# Altium schematic sheet TSAL.SchDoc: QUTMS - HVBoard - TSAL
size A4; DocumentNumber: 3; SheetNumber: 3; SheetTotal: 5
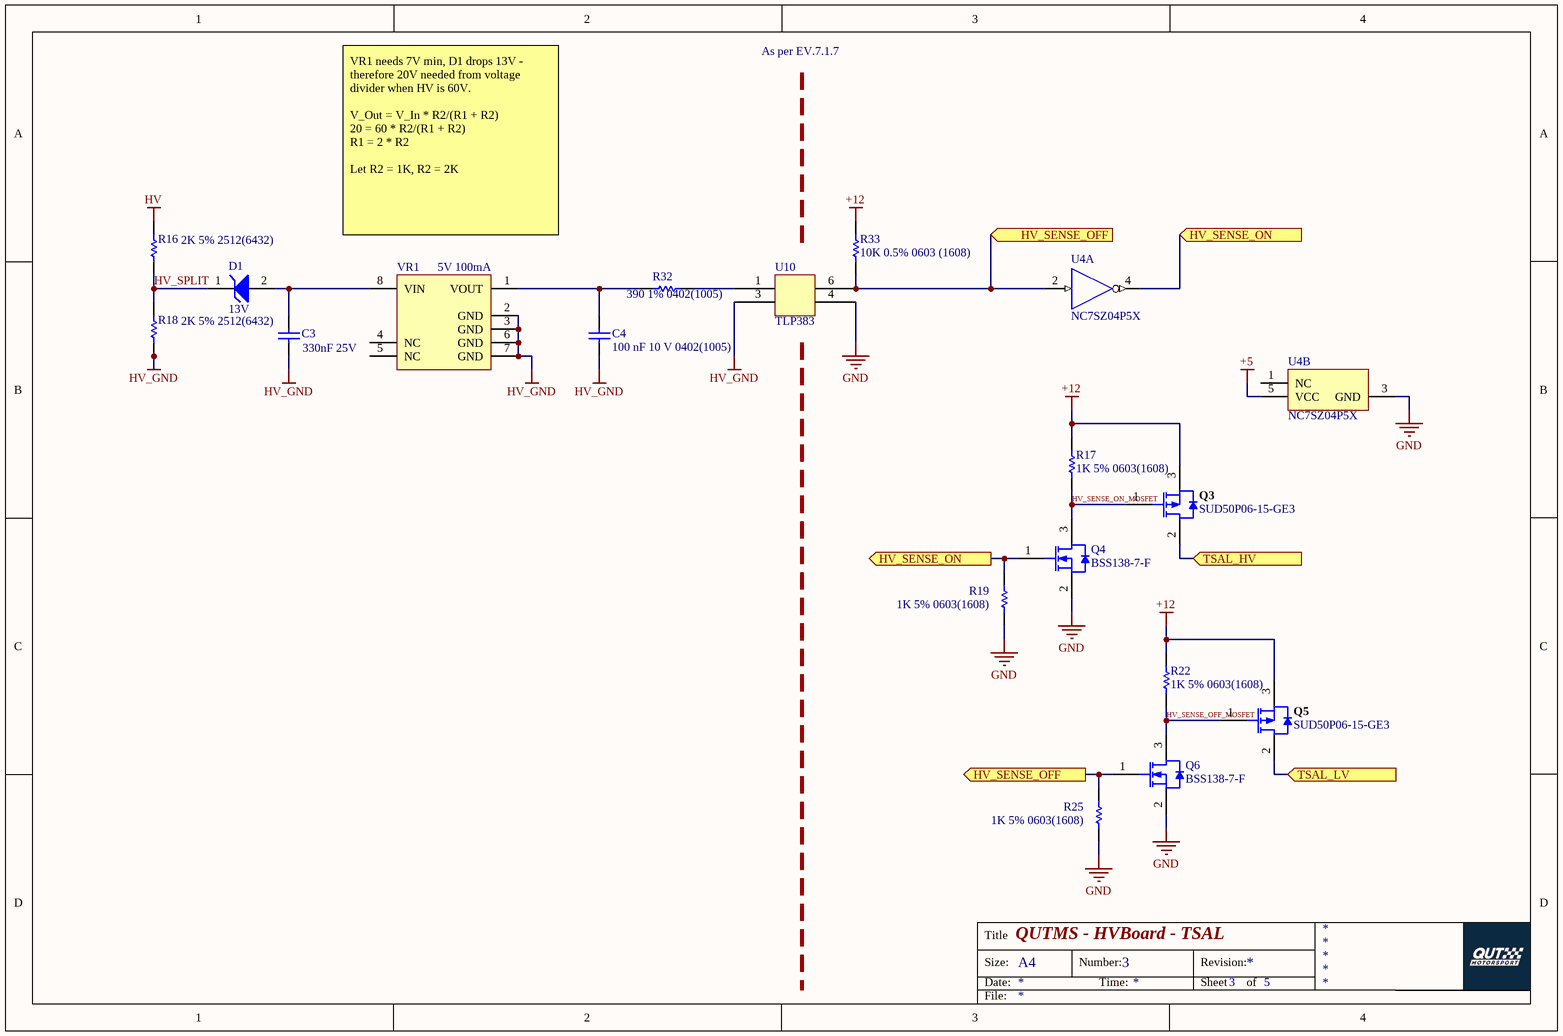
[diagram p0: TSAL.SchDoc]

## Parts
C3  330nF 25V  [CAPC0603(1608)100_M]
C4  100 nF 10 V 0402(1005)  [CAPC1005X60X30ML05T10]
D1  13V  [ONSC-SOD-323-2-477-02_V]
Q3  SUD50P06-15-GE3  [VSIL-TO-252AA-3_V]
Q4  BSS138-7-F  [DIOD-SOT23-3_V]
Q5  SUD50P06-15-GE3  [VSIL-TO-252AA-3_V]
Q6  BSS138-7-F  [DIOD-SOT23-3_V]
R16  2K 5% 2512(6432)  [RESC2512(6432)_L]
R17  1K 5% 0603(1608)  [RESC0603(1608)_L]
R18  2K 5% 2512(6432)  [RESC2512(6432)_L]
R19  1K 5% 0603(1608)  [RESC0603(1608)_L]
R22  1K 5% 0603(1608)  [RESC0603(1608)_L]
R25  1K 5% 0603(1608)  [RESC0603(1608)_L]
R32  390 1% 0402(1005)  [RESC1609X50X30NL10T20]
R33  10K 0.5% 0603 (1608)  [RESC1608X50X30LL20T20]
U4  NC7SZ04P5X  [FAIR-SC70-5_V]  (parts A,B of 2)
U10  TLP383  [TLP383]
VR1  5V 100mA  [SO8_N]

## Ports
HV_SENSE_OFF (in), HV_SENSE_OFF (out), HV_SENSE_ON (in), HV_SENSE_ON (out), TSAL_HV (in), TSAL_LV (in)

## Nets
+5: U4.5(VCC)
+12: Q3.3(S) Q5.3(S) R17.2 R22.2 R33.2
GND: Q4.2(S) Q6.2(S) R19.1 R25.1 U4.3(GND) U10.4
HV: R16.2
HV_GND: C3.1 C4.1 R18.1 U10.3 VR1.2(GND) VR1.3(GND) VR1.6(GND) VR1.7(GND)
HV_SENSE_OFF: Q6.1(G) R25.2 R33.1 U4.2(A) U10.6 ; port HV_SENSE_OFF
HV_SENSE_OFF_MOSFET: Q5.1(G) Q6.3(D) R22.1
HV_SENSE_ON: Q4.1(G) R19.2 U4.4(Y) ; port HV_SENSE_ON
HV_SENSE_ON_MOSFET: Q3.1(G) Q4.3(D) R17.1
HV_SPLIT: D1.1(K) R16.1 R18.2
TSAL_HV: Q3.2(D) ; port TSAL_HV
TSAL_LV: Q5.2(D) ; port TSAL_LV
NetC3_2: C3.2 D1.2(A) VR1.8(VIN)
NetC4_2: C4.2 R32.1 VR1.1(VOUT)
NetR32_2: R32.2 U10.1

Not connected (* = marked no-connect by the designer): U4 1(NC); VR1 4(NC) 5(NC)

## Notes on the sheet
- As per EV.7.1.7
- VR1 needs 7V min, D1 drops 13V - therefore 20V needed from voltage divider when HV is 60V.
  V_Out = V_In * R2/(R1 + R2)
  20 = 60 * R2/(R1 + R2)
  R1 = 2 * R2
  Let R2 = 1K, R2 = 2K
- Title
- Size:
- Date:
- A4
- Number:
- Time:
- Revision:
- Sheet
- of
- File:

## Library data of the parts
C3 = CMP-1035-02675-1: CAP 330nF 25V ±20% 0603 (1608 Metric) Thickness 1mm SMD; Case-EIA: 0603; Case-Metric: 1608; Tolerance: Â±20%; Max Thickness: 1 mm; Technology: SMT; Rated Voltage: 25 V; Value: 330nF
C4 = CMP-2008-02063-1: Part Number: C0402C104K8PAC7867; Manufacturer: Kemet
D1 = CMP-1060-00637-1: Zener Voltage Regulator, 300 mW, Tight Tolerance Portfolio, 2-Pin SOD-323, Pb-Free, Tape and Reel; PartNumber: MM3Z13VT1G; Manufacturer: On Semiconductor; P Max (W): 0.3; VZ Typ (V): 13.25; ComponentLink2URL: http://www.onsemi.cn/pub_link/Collateral/MM3Z2V4ST1-D.PDF; RoHS: Pb-Free; PackageVersion: Rev. H, 03/2007; PackageReference: SOD-323-2-477-02; DatasheetVersion: Rev. 21; ComponentLink2Description: Datasheet; Mounting Technology: Surface Mount; Packing: Tape and Reel; ComponentLink1Description: Manufacturer URL; ComponentLink1URL: http://www.onsemi.com/; ComponentLink3Description: Package Specification; PackageDescription: 2-Pin SOD, Body 1.7 x 1.25 mm; ComponentLink3URL: http://www.onsemi.com/pub_link/Collateral/477-02.PDF.1
Q3 Q5 = CMP-2000-05431-1: P-Channel (D-S) MOSFET, 30 V, -55 to 150 degC, 3-Pin TO-252, RoHS, Tape and Reel; Manufacturer: Vishay; Unit Weight: 0.050717oz; Id - Continuous Drain Current: 50A; Rise Time: 70ns; Fall Time: 175ns; Configuration: Single; Rds On - Drain-Source Resistance: 15mOhms; Transistor Type: 1P-Channel; Channel Mode: Enhancement; Number of Channels: 1Channel; Typical Turn-On Delay Time: 15ns; Brand: VishaySemiconductors; Pd - Power Dissipation: 2.5W; Vds - Drain-Source Breakdown Voltage: -60V; Vgs - Gate-Source Voltage: 20V; Mounting Style: SMD/SMT; Package / Case: TO-252AA-3; Height: 2.39mm; Datasheet Version: Rev. C, 07/2013; Factory Pack Quantity: 2000; RoHS: True; Typical Turn-Off Delay Time: 175ns; Minimum Operating Temperature: -55C; Tradename: TrenchFET; Manufacturer URL: http://www.vishay.com/; Package Description: 3-Pin Surface Mount Device, Body 6.54 x 6.095 mm, Pitch 2.28 mm; Package Reference: TO-252; Transistor Polarity: P-Channel; Technology: Si; Series: SUD; Datasheet URL: https://datasheet.ciiva.com/4444/sud50p06-244530-4444327.pdf; Width: 6.22mm; Product Category: MOSFET; Packaging: Reel; Length: 6.73mm; Package URL: http://www.vishay.com/docs/89975/v15wl45c-m3.pdf; Maximum Operating Temperature: +150C
Q4 Q6 = CMP-2000-04930-1: N-Channel Enhancement Mode Mosfet, 50 V, 0.2 A, -55 to 150 degC, 3-Pin SOT23, RoHS, Tape and Reel; Manufacturer: Diodes Inc; Brand: DiodesIncorporated; Unit Weight: 0.000282oz; Pd - Power Dissipation: 300mW; Id - Continuous Drain Current: 200mA; Rds On - Drain-Source Resistance: 3.5Ohms; Vgs - Gate-Source Voltage: 20V; Number of Channels: 1Channel; Vds - Drain-Source Breakdown Voltage: 50V; Transistor Type: 1N-Channel; Typical Turn-Off Delay Time: 20ns; Configuration: Single; Mounting Style: SMD/SMT; Height: 1mm; Package Description: 3-Pin Small Outline Transistor, Body 2.9 x 1.3 mm, Pitch 0.96 mm; Datasheet Version: Rev. 20-2, 11/2013; Minimum Operating Temperature: -55C; Package / Case: SOT-23-3; Channel Mode: Enhancement; Product: MOSFETSmallSignal; Packaging: Reel; Maximum Operating Temperature: +150C; Datasheet URL: https://datasheet.ciiva.com/8115/ds30144-8115344.pdf; Product Category: MOSFET; Width: 1.3mm; Technology: Si; Package Reference: SOT23-3; Manufacturer URL: http://www.diodes.com/; Transistor Polarity: N-Channel; Length: 2.9mm; Factory Pack Quantity: 3000; Series: BSS138; RoHS: True; Typical Turn-On Delay Time: 20ns
R16 R18 = CMP-1018-00081-1: 2K 1W 5% 2512 (6432 Metric)  SMD; Case-Metric: 6432; Case-EIA: 2512; Value: 2000.00 Ohm; Power: 1 W; Tolerance: 5 %; Technology: SMT
R17 R19 R22 R25 = CMP-1012-00074-1: 1K 0.1W 5% 0603 (1608 Metric)  SMD; Case-EIA: 0603; Case-Metric: 1608; Value: 1000.00 Ohm; Technology: SMT; Tolerance: 5 %; Power: 0.1 W
R32 = CMP-2000-03266-1: Manufacturer: Vishay Dale; Part Number: CRCW0603360RFKEA
R33 = CMP-2000-02424-1: Part Number: RR0816P-103-D; Manufacturer: Susumu
U4 = CMP-2000-06814-1: TinyLogic(R) UHS Inverter, 32 mA, 1.65 to 5.5 V, -40 to 85 degC, 5-Pin SOT23 (SC70), RoHS, Tape and Reel; Manufacturer: FairchildSemiconductor; Maximum Propagation Delay Time @ Maximum CL: 5@3.3V; Typical Operating Supply Voltage: 1.8; Number of Elements per Chip: 1; Rad Hard: No; Maximum Low Level Output Current: 32mA; Fabrication Technology: CMOS; Propagation Delay Test Condition: 50pF; Maximum High Level Output Current: -32mA; Logic Family: TinyLogicUHS; Package URL: https://www.fairchildsemi.com/package-drawings/MA/MAA05A.pdf; Datasheet Version: Rev. 1.0.5, 02/2011; Package Reference: SC70-5; Package Description: 5-Pin Small Outline Transistor, Body 2 x 1.25 mm, Pitch 0.65 mm; Mounting Technology: SurfaceMount; Logic Function: Inverter; Package: 5SC-70; Category: InverterSchmittTrigger; Packaging: Tape&Reel; Manufacturer URL: https://www.fairchildsemi.com/; Datasheet URL: https://www.fairchildsemi.com/datasheets/NC/NC7SZ04.pdf; Operating Temperature: -40to85°C
VR1 = CMP-0244-00242-1: Positive Voltage Regulator, 5V, 8-Pin SO, Tape and Reel; ComponentLink2URL: http://www.st.com/internet/com/TECHNICAL_RESOURCES/TECHNICAL_LITERATURE/DATASHEET/CD00000446.pdf; ComponentLink3URL: http://www.st.com/internet/com/TECHNICAL_RESOURCES/TECHNICAL_LITERATURE/PACKAGE_INFORMATION/CD00004680.pdf; Code_IPC: SOIC127P600-8; PackageDescription: 8-Pin Small Outline Integrated Circuit 1.27 mm Pitch; ComponentLink3Description: Package Specification; ComponentLink2Description: Datasheet; DatasheetVersion: 1/02/2011; PackageVersion: 1/12/2002; Code_JEDEC: MS-012-AA; ComponentLink1URL: http://www.st.com; ComponentLink1Description: Manufacturer URL; PackageReference: SO8